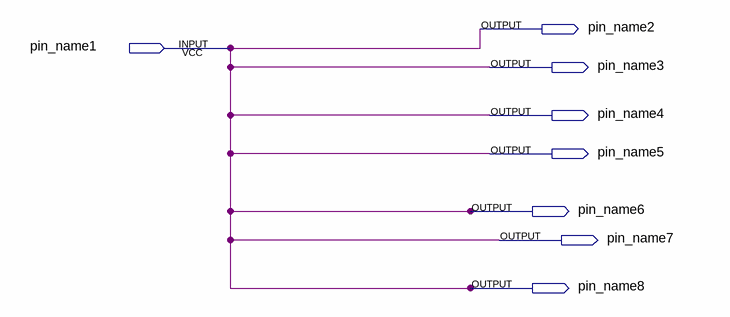
[diagram p0: schematic sheet]
// Quartus schematic ercii.bdf as structural Verilog: 0 symbols, 8 pins
module ercii (
  input  pin_name1,
  output pin_name2,
  output pin_name3,
  output pin_name4,
  output pin_name5,
  output pin_name6,
  output pin_name7,
  output pin_name8
);


  assign pin_name2 = pin_name1;
  assign pin_name3 = pin_name1;
  assign pin_name4 = pin_name1;
  assign pin_name5 = pin_name1;
  assign pin_name6 = pin_name1;
  assign pin_name7 = pin_name1;
  assign pin_name8 = pin_name1;
endmodule
